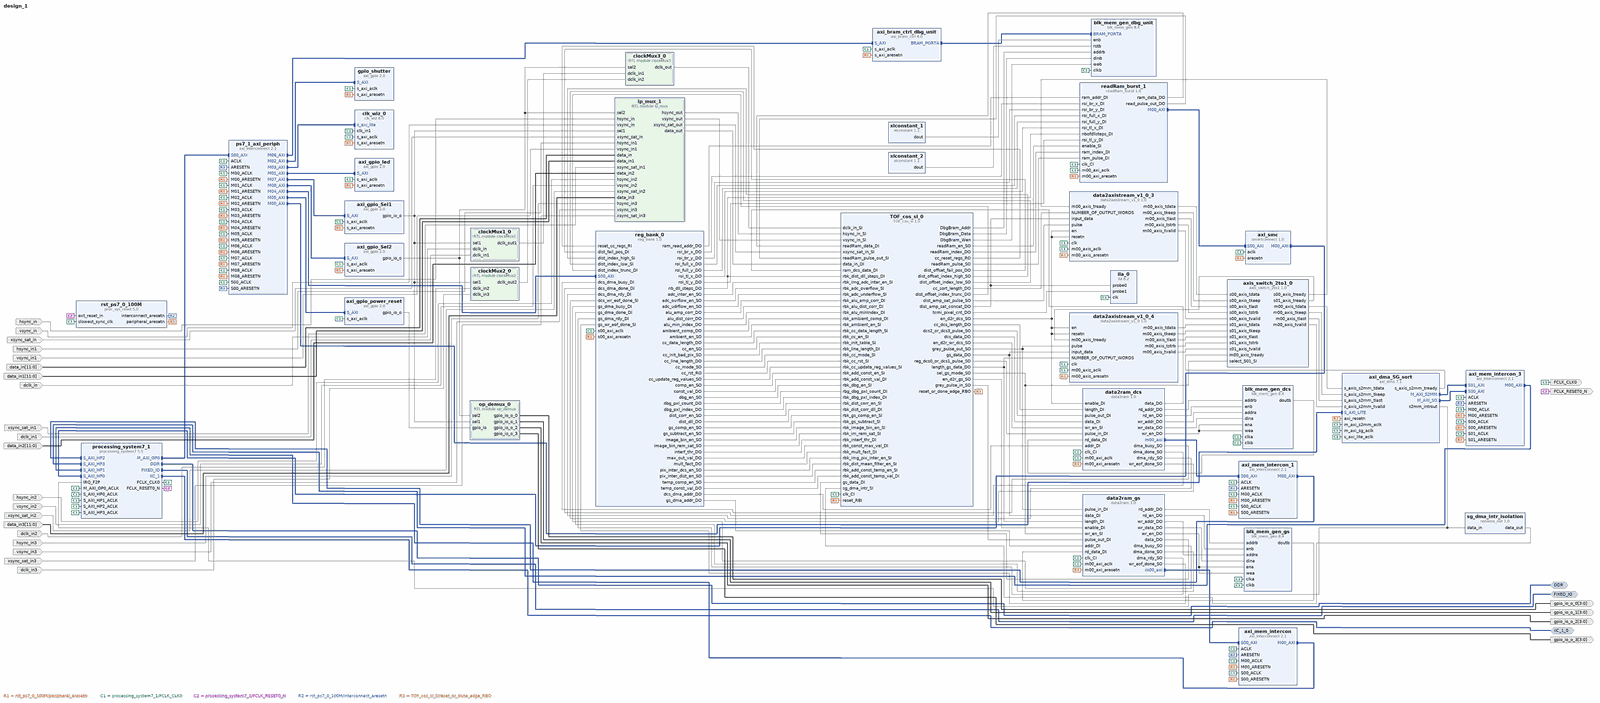
[diagram p0: block diagram of the top level, whole]
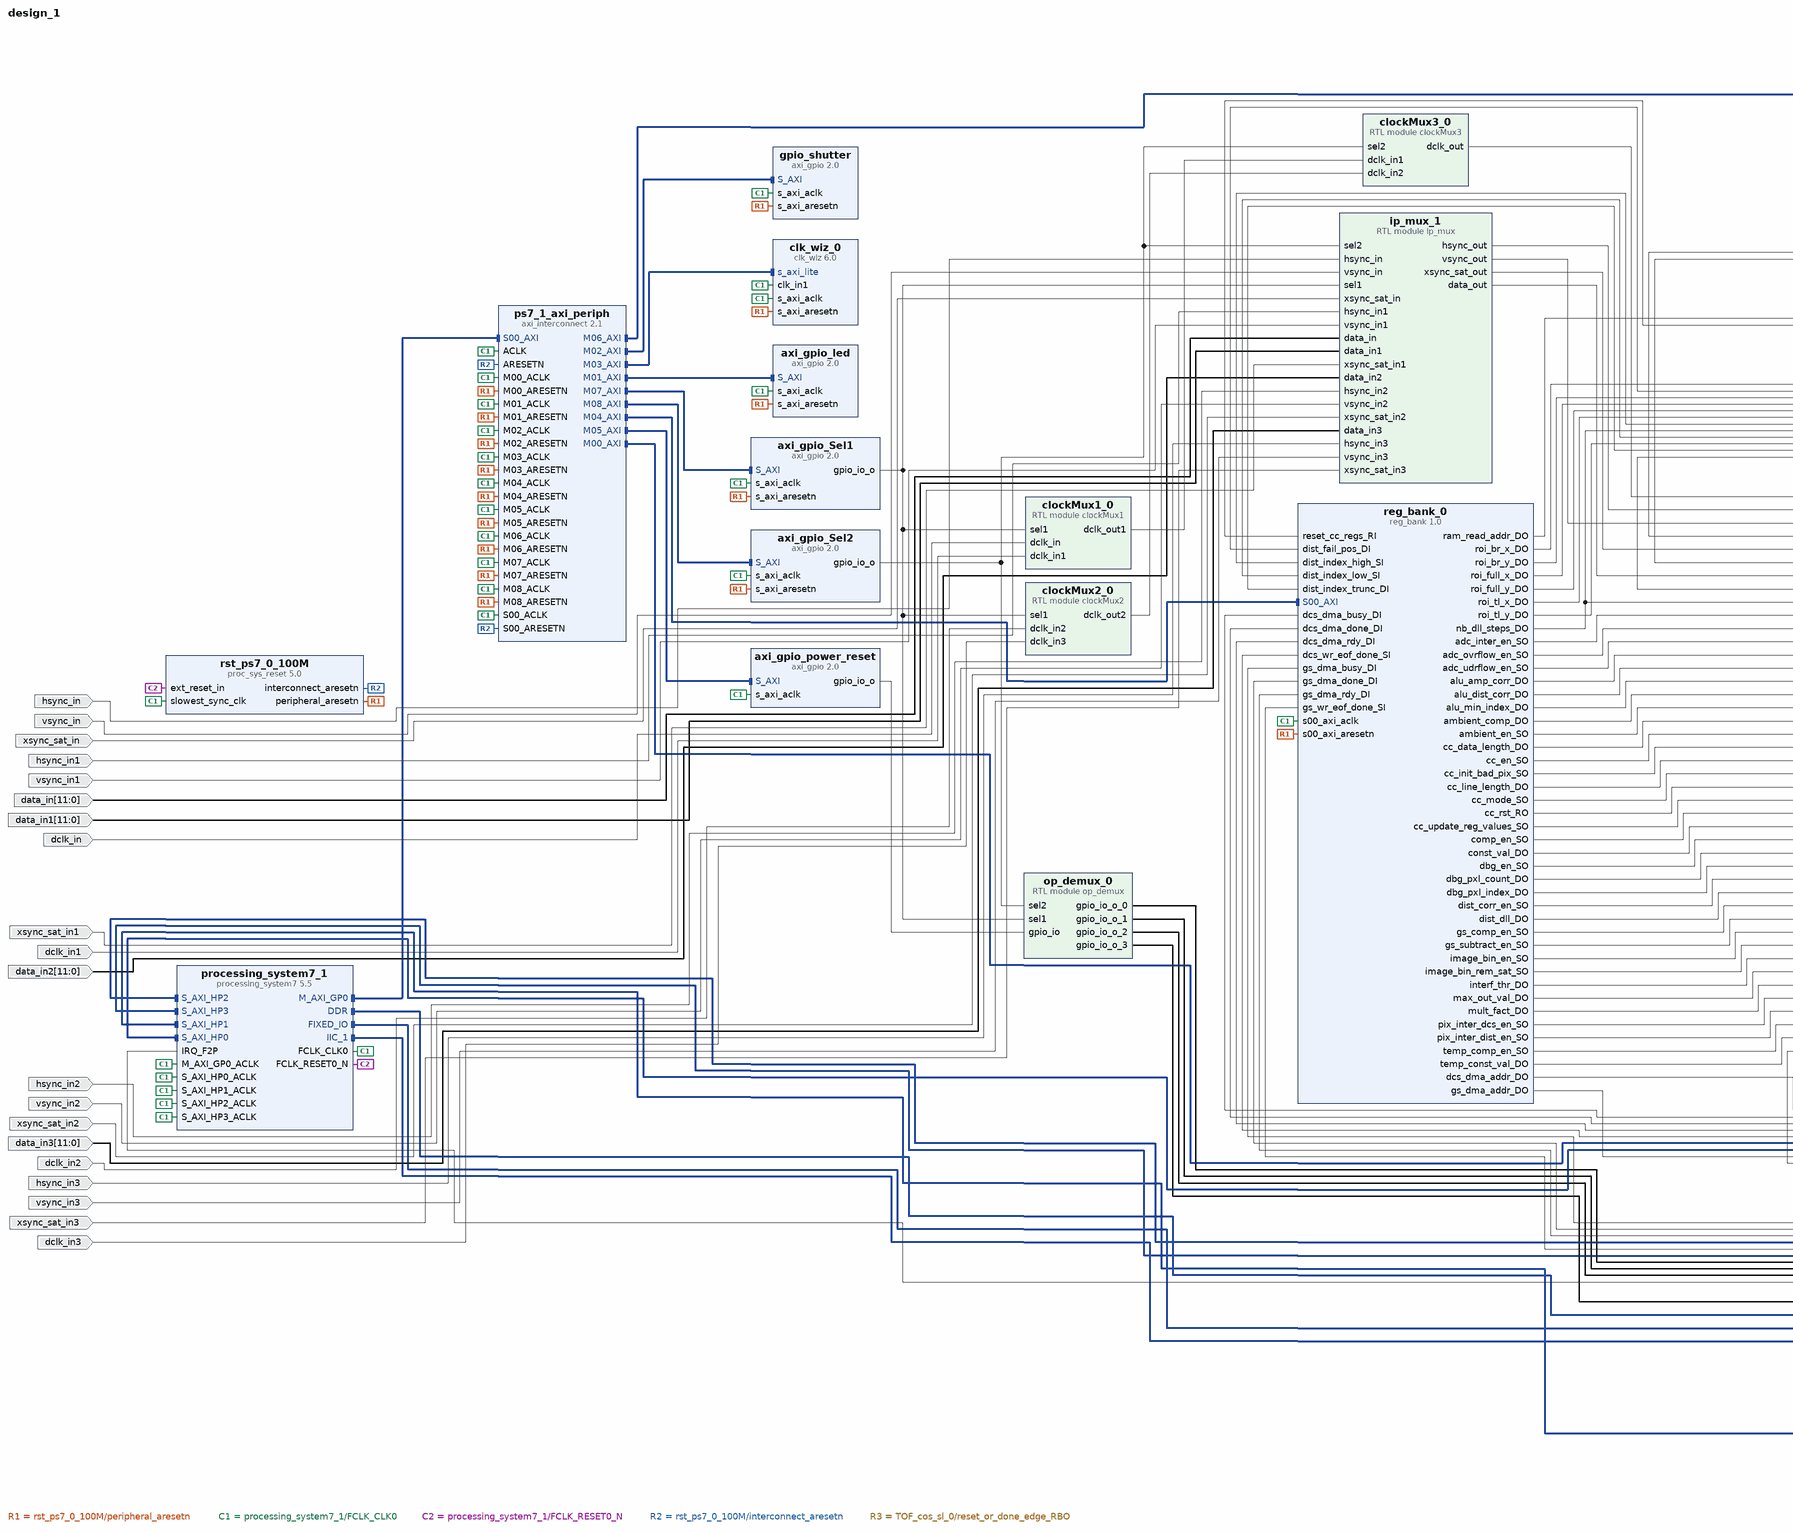
[diagram p1: block diagram of the top level, left part]
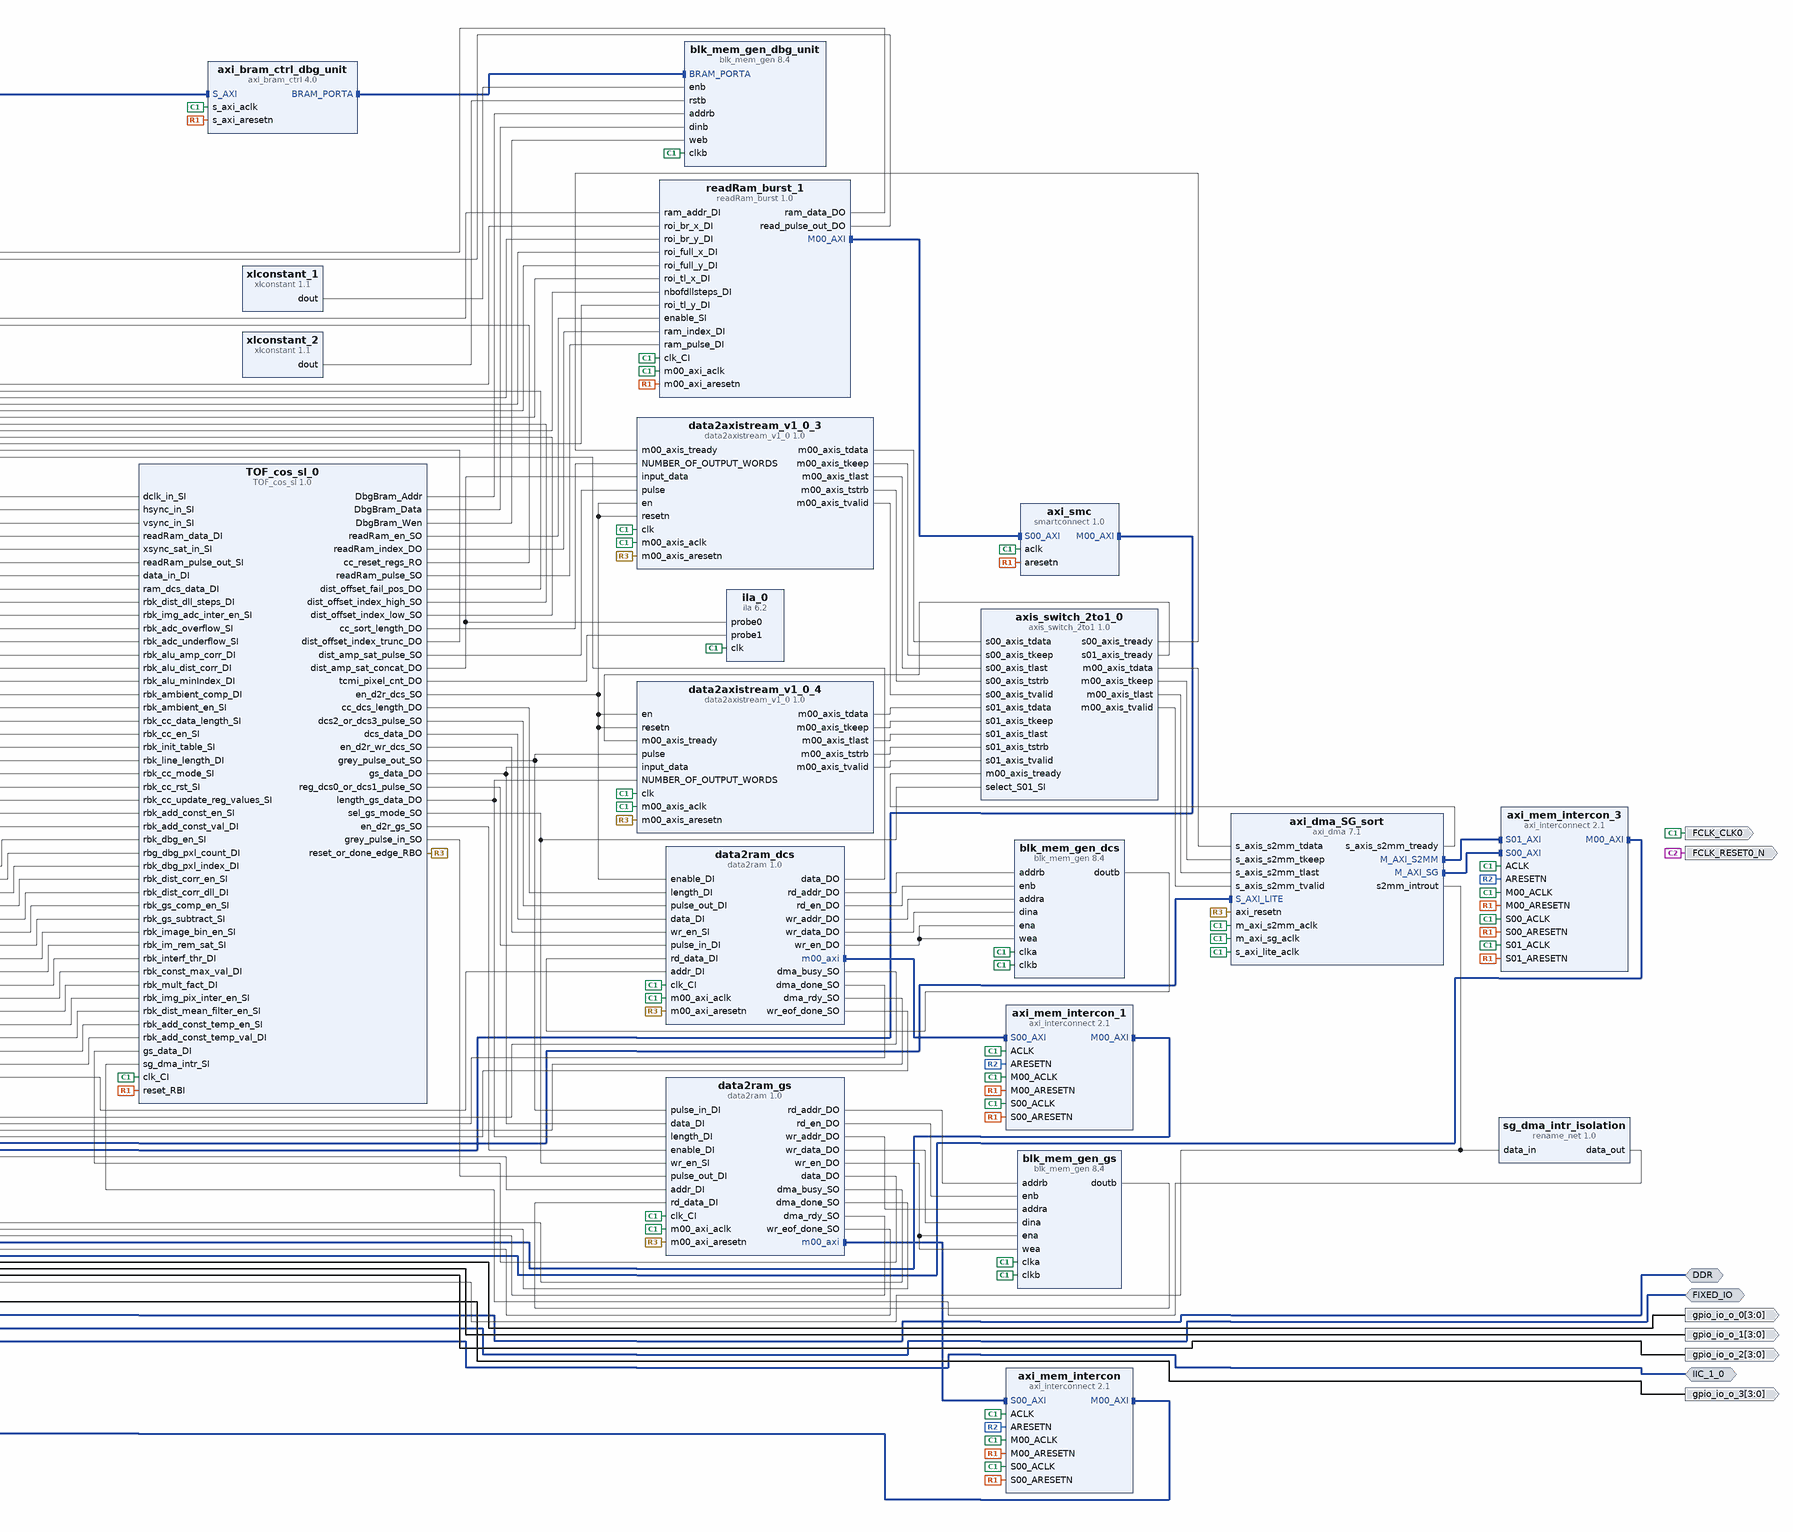
[diagram p2: block diagram of the top level, right part]
# Vivado block design design_1, xc7z020clg400-1, Vivado 2018.2.2
create_bd_design design_1

create_bd_intf_port -mode Master -vlnv xilinx.com:interface:ddrx_rtl:1.0 DDR
create_bd_intf_port -mode Master -vlnv xilinx.com:display_processing_system7:fixedio_rtl:1.0 FIXED_IO
create_bd_intf_port -mode Master -vlnv xilinx.com:interface:iic_rtl:1.0 IIC_1_0
create_bd_port -dir O FCLK_CLK0
create_bd_port -dir O FCLK_RESET0_N
create_bd_port -dir I hsync_in
create_bd_port -dir I vsync_in
create_bd_port -dir I xsync_sat_in
create_bd_port -dir I hsync_in1
create_bd_port -dir I vsync_in1
create_bd_port -dir O -from 3 -to 0 gpio_io_o_0
create_bd_port -dir O -from 3 -to 0 gpio_io_o_1
create_bd_port -dir I -from 11 -to 0 data_in
create_bd_port -dir I -from 11 -to 0 data_in1
create_bd_port -dir I xsync_sat_in1
create_bd_port -dir I dclk_in
create_bd_port -dir I dclk_in1
create_bd_port -dir I -from 11 -to 0 data_in2
create_bd_port -dir I hsync_in2
create_bd_port -dir I vsync_in2
create_bd_port -dir I xsync_sat_in2
create_bd_port -dir I -from 11 -to 0 data_in3
create_bd_port -dir I hsync_in3
create_bd_port -dir I vsync_in3
create_bd_port -dir I xsync_sat_in3
create_bd_port -dir I dclk_in2
create_bd_port -dir I dclk_in3
create_bd_port -dir O -from 3 -to 0 gpio_io_o_2
create_bd_port -dir O -from 3 -to 0 gpio_io_o_3

create_bd_cell -type ip -vlnv xilinx.com:espros:TOF_cos_sl:1.0 TOF_cos_sl_0
set_property -dict {CONFIG.ENABLE_INPUT_FIFO true} [get_bd_cells TOF_cos_sl_0]
create_bd_cell -type ip -vlnv xilinx.com:ip:axi_bram_ctrl:4.0 axi_bram_ctrl_dbg_unit
set_property -dict {CONFIG.SINGLE_PORT_BRAM 1} [get_bd_cells axi_bram_ctrl_dbg_unit]
create_bd_cell -type ip -vlnv xilinx.com:ip:axi_dma:7.1 axi_dma_SG_sort
set_property -dict [list \
  CONFIG.c_enable_multi_channel 0 \
  CONFIG.c_sg_length_width 23 \
  CONFIG.c_sg_include_stscntrl_strm 0 \
  CONFIG.c_include_mm2s 0 \
  CONFIG.c_include_s2mm_dre 0 \
  CONFIG.c_s2mm_burst_size 16 \
] [get_bd_cells axi_dma_SG_sort]
create_bd_cell -type ip -vlnv xilinx.com:ip:axi_gpio:2.0 axi_gpio_led
set_property -dict [list \
  CONFIG.C_GPIO_WIDTH 1 \
  CONFIG.C_GPIO2_WIDTH 1 \
  CONFIG.C_IS_DUAL 1 \
  CONFIG.C_ALL_INPUTS_2 0 \
  CONFIG.C_INTERRUPT_PRESENT 0 \
  CONFIG.C_ALL_OUTPUTS 1 \
  CONFIG.C_ALL_OUTPUTS_2 1 \
] [get_bd_cells axi_gpio_led]
create_bd_cell -type ip -vlnv xilinx.com:ip:axi_gpio:2.0 axi_gpio_power_reset
set_property -dict {CONFIG.C_GPIO_WIDTH 4 CONFIG.C_ALL_OUTPUTS 1} [get_bd_cells axi_gpio_power_reset]
create_bd_cell -type ip -vlnv xilinx.com:ip:axi_interconnect:2.1 axi_mem_intercon
set_property -dict {CONFIG.NUM_MI 1} [get_bd_cells axi_mem_intercon]
create_bd_cell -type ip -vlnv xilinx.com:ip:axi_interconnect:2.1 axi_mem_intercon_1
set_property -dict {CONFIG.NUM_MI 1 CONFIG.S00_HAS_DATA_FIFO 0} [get_bd_cells axi_mem_intercon_1]
create_bd_cell -type ip -vlnv xilinx.com:ip:axi_interconnect:2.1 axi_mem_intercon_3
set_property -dict {CONFIG.NUM_SI 2 CONFIG.NUM_MI 1} [get_bd_cells axi_mem_intercon_3]
create_bd_cell -type ip -vlnv xilinx.com:ip:smartconnect:1.0 axi_smc
set_property -dict {CONFIG.NUM_SI 1} [get_bd_cells axi_smc]
create_bd_cell -type ip -vlnv xilinx.com:user:axis_switch_2to1:1.0 axis_switch_2to1_0
create_bd_cell -type ip -vlnv xilinx.com:ip:blk_mem_gen:8.4 blk_mem_gen_dbg_unit
set_property -dict [list \
  CONFIG.Memory_Type True_Dual_Port_RAM \
  CONFIG.Enable_32bit_Address true \
  CONFIG.Assume_Synchronous_Clk false \
  CONFIG.Operating_Mode_A WRITE_FIRST \
  CONFIG.Enable_B Use_ENB_Pin \
  CONFIG.Register_PortA_Output_of_Memory_Primitives false \
  CONFIG.Register_PortB_Output_of_Memory_Primitives false \
  CONFIG.Use_RSTA_Pin true \
  CONFIG.Use_RSTB_Pin true \
  CONFIG.Port_B_Clock 100 \
  CONFIG.Port_B_Write_Rate 50 \
  CONFIG.Port_B_Enable_Rate 100 \
  CONFIG.use_bram_block BRAM_Controller \
  CONFIG.EN_SAFETY_CKT true \
] [get_bd_cells blk_mem_gen_dbg_unit]
create_bd_cell -type ip -vlnv xilinx.com:ip:blk_mem_gen:8.4 blk_mem_gen_dcs
set_property -dict [list \
  CONFIG.Memory_Type Simple_Dual_Port_RAM \
  CONFIG.Enable_32bit_Address false \
  CONFIG.Use_Byte_Write_Enable false \
  CONFIG.Assume_Synchronous_Clk true \
  CONFIG.Write_Width_A 16 \
  CONFIG.Write_Depth_A 2048 \
  CONFIG.Operating_Mode_A NO_CHANGE \
  CONFIG.Write_Width_B 16 \
  CONFIG.Read_Width_B 16 \
  CONFIG.Enable_B Use_ENB_Pin \
  CONFIG.Register_PortB_Output_of_Memory_Primitives true \
  CONFIG.Port_B_Clock 100 \
  CONFIG.Port_B_Enable_Rate 100 \
  CONFIG.use_bram_block Stand_Alone \
] [get_bd_cells blk_mem_gen_dcs]
create_bd_cell -type ip -vlnv xilinx.com:ip:blk_mem_gen:8.4 blk_mem_gen_gs
set_property -dict [list \
  CONFIG.Memory_Type Simple_Dual_Port_RAM \
  CONFIG.Enable_32bit_Address false \
  CONFIG.Use_Byte_Write_Enable false \
  CONFIG.Assume_Synchronous_Clk true \
  CONFIG.Write_Width_A 13 \
  CONFIG.Write_Depth_A 2048 \
  CONFIG.Operating_Mode_A NO_CHANGE \
  CONFIG.Write_Width_B 13 \
  CONFIG.Read_Width_B 13 \
  CONFIG.Enable_B Use_ENB_Pin \
  CONFIG.Register_PortB_Output_of_Memory_Primitives true \
  CONFIG.Port_B_Clock 100 \
  CONFIG.Port_B_Enable_Rate 100 \
  CONFIG.use_bram_block Stand_Alone \
] [get_bd_cells blk_mem_gen_gs]
create_bd_cell -type ip -vlnv xilinx.com:ip:clk_wiz:6.0 clk_wiz_0
set_property -dict [list \
  CONFIG.USE_FREQ_SYNTH false \
  CONFIG.USE_PHASE_ALIGNMENT false \
  CONFIG.USE_DYN_RECONFIG true \
  CONFIG.SECONDARY_SOURCE Single_ended_clock_capable_pin \
  CONFIG.CLK_OUT1_PORT epc_modclk \
  CONFIG.CLKOUT1_REQUESTED_OUT_FREQ 100.000 \
  CONFIG.CLKOUT1_DRIVES BUFG \
  CONFIG.CLKOUT2_DRIVES BUFG \
  CONFIG.CLKOUT3_DRIVES BUFG \
  CONFIG.CLKOUT4_DRIVES BUFG \
  CONFIG.CLKOUT5_DRIVES BUFG \
  CONFIG.CLKOUT6_DRIVES BUFG \
  CONFIG.CLKOUT7_DRIVES BUFG \
  CONFIG.USE_RESET true \
  CONFIG.OVERRIDE_MMCM false \
  CONFIG.MMCM_DIVCLK_DIVIDE 1 \
  CONFIG.MMCM_CLKFBOUT_MULT_F 10.000 \
  CONFIG.MMCM_CLKOUT0_DIVIDE_F 10.000 \
  CONFIG.CLKOUT1_JITTER 130.958 \
  CONFIG.CLKOUT1_PHASE_ERROR 98.575 \
] [get_bd_cells clk_wiz_0]
create_bd_cell -type ip -vlnv msc:msc:data2axistream_v1_0:1.0 data2axistream_v1_0_3
set_property -dict {CONFIG.INPUT_BUS_WIDTH 32 CONFIG.INPUT_FIFO_BITS 2} [get_bd_cells data2axistream_v1_0_3]
create_bd_cell -type ip -vlnv msc:msc:data2axistream_v1_0:1.0 data2axistream_v1_0_4
set_property -dict {CONFIG.INPUT_BUS_WIDTH 13} [get_bd_cells data2axistream_v1_0_4]
create_bd_cell -type ip -vlnv xilinx.com:user:data2ram:1.0 data2ram_dcs
set_property -dict [list \
  CONFIG.NBITS_INPUT 16 \
  CONFIG.NBITS_LENGTH 17 \
  CONFIG.NBITS_BRAM_ADDR 11 \
  CONFIG.C_M00_AXI_BURST_LEN 16 \
  CONFIG.PRELOAD_RD_PULSE true \
] [get_bd_cells data2ram_dcs]
create_bd_cell -type ip -vlnv xilinx.com:user:data2ram:1.0 data2ram_gs
set_property -dict [list \
  CONFIG.NBITS_INPUT 13 \
  CONFIG.NBITS_LENGTH 19 \
  CONFIG.NBITS_BRAM_ADDR 11 \
  CONFIG.C_M00_AXI_BURST_LEN 16 \
  CONFIG.PRELOAD_RD_PULSE true \
] [get_bd_cells data2ram_gs]
create_bd_cell -type ip -vlnv xilinx.com:ip:axi_gpio:2.0 gpio_shutter
set_property -dict [list \
  CONFIG.C_GPIO_WIDTH 1 \
  CONFIG.C_GPIO2_WIDTH 1 \
  CONFIG.C_IS_DUAL 1 \
  CONFIG.C_ALL_INPUTS_2 0 \
  CONFIG.C_ALL_OUTPUTS 1 \
  CONFIG.C_ALL_OUTPUTS_2 1 \
] [get_bd_cells gpio_shutter]
create_bd_cell -type ip -vlnv xilinx.com:ip:processing_system7:5.5 processing_system7_1
set_property -dict [list \
  CONFIG.PCW_UIPARAM_DDR_FREQ_MHZ 533.333333 \
  CONFIG.PCW_APU_PERIPHERAL_FREQMHZ 667 \
  CONFIG.PCW_SDIO_PERIPHERAL_FREQMHZ 25 \
  CONFIG.PCW_UART_PERIPHERAL_FREQMHZ 50 \
  CONFIG.PCW_I2C_PERIPHERAL_FREQMHZ 111.111115 \
  CONFIG.PCW_FPGA0_PERIPHERAL_FREQMHZ 100 \
  CONFIG.PCW_FPGA1_PERIPHERAL_FREQMHZ 20 \
  CONFIG.PCW_FPGA2_PERIPHERAL_FREQMHZ 33.333333 \
  CONFIG.PCW_USE_S_AXI_HP0 1 \
  CONFIG.PCW_USE_S_AXI_HP1 1 \
  CONFIG.PCW_USE_S_AXI_HP2 1 \
  CONFIG.PCW_USE_S_AXI_HP3 1 \
  CONFIG.PCW_USE_FABRIC_INTERRUPT 1 \
  CONFIG.PCW_GPIO_EMIO_GPIO_WIDTH 2 \
  CONFIG.PCW_IRQ_F2P_INTR 1 \
  CONFIG.PCW_GP0_EN_MODIFIABLE_TXN 0 \
  CONFIG.PCW_GP1_EN_MODIFIABLE_TXN 0 \
  CONFIG.PCW_PERIPHERAL_BOARD_PRESET part0 \
  CONFIG.PCW_PRESET_BANK1_VOLTAGE {LVCMOS 1.8V} \
  CONFIG.PCW_UIPARAM_DDR_PARTNO {MT41K256M16 RE-125} \
  CONFIG.PCW_QSPI_PERIPHERAL_ENABLE 1 \
  CONFIG.PCW_QSPI_QSPI_IO {MIO 1 .. 6} \
  CONFIG.PCW_QSPI_GRP_SINGLE_SS_ENABLE 1 \
  CONFIG.PCW_QSPI_GRP_SINGLE_SS_IO {MIO 1 .. 6} \
  CONFIG.PCW_SINGLE_QSPI_DATA_MODE x4 \
  CONFIG.PCW_QSPI_GRP_FBCLK_ENABLE 1 \
  CONFIG.PCW_QSPI_GRP_FBCLK_IO {MIO 8} \
  CONFIG.PCW_ENET0_PERIPHERAL_ENABLE 1 \
  CONFIG.PCW_ENET0_ENET0_IO {MIO 16 .. 27} \
  CONFIG.PCW_ENET0_GRP_MDIO_ENABLE 1 \
  CONFIG.PCW_ENET0_GRP_MDIO_IO {MIO 52 .. 53} \
  CONFIG.PCW_ENET_RESET_ENABLE 1 \
  CONFIG.PCW_ENET_RESET_SELECT {Share reset pin} \
  CONFIG.PCW_ENET0_RESET_ENABLE 0 \
  CONFIG.PCW_SD0_PERIPHERAL_ENABLE 1 \
  CONFIG.PCW_SD0_SD0_IO {MIO 40 .. 45} \
  CONFIG.PCW_SD0_GRP_CD_ENABLE 1 \
  CONFIG.PCW_SD0_GRP_CD_IO {MIO 46} \
  CONFIG.PCW_SD0_GRP_WP_ENABLE 1 \
  CONFIG.PCW_SD0_GRP_WP_IO {MIO 50} \
  CONFIG.PCW_UART1_PERIPHERAL_ENABLE 1 \
  CONFIG.PCW_UART1_UART1_IO {MIO 48 .. 49} \
  CONFIG.PCW_CAN0_PERIPHERAL_ENABLE 1 \
  CONFIG.PCW_CAN0_CAN0_IO {MIO 10 .. 11} \
  CONFIG.PCW_TTC0_PERIPHERAL_ENABLE 1 \
  CONFIG.PCW_TTC0_TTC0_IO EMIO \
  CONFIG.PCW_USB0_PERIPHERAL_ENABLE 1 \
  CONFIG.PCW_USB0_USB0_IO {MIO 28 .. 39} \
  CONFIG.PCW_USB_RESET_ENABLE 1 \
  CONFIG.PCW_USB_RESET_SELECT {Share reset pin} \
  CONFIG.PCW_USB0_RESET_ENABLE 1 \
  CONFIG.PCW_USB0_RESET_IO {MIO 7} \
  CONFIG.PCW_I2C0_PERIPHERAL_ENABLE 1 \
  CONFIG.PCW_I2C0_I2C0_IO {MIO 14 .. 15} \
  CONFIG.PCW_I2C0_GRP_INT_ENABLE 0 \
  CONFIG.PCW_I2C1_PERIPHERAL_ENABLE 1 \
  CONFIG.PCW_I2C1_I2C1_IO EMIO \
  CONFIG.PCW_I2C_RESET_ENABLE 0 \
  CONFIG.PCW_GPIO_PERIPHERAL_ENABLE 1 \
  CONFIG.PCW_GPIO_MIO_GPIO_ENABLE 1 \
  CONFIG.PCW_GPIO_MIO_GPIO_IO MIO \
  CONFIG.PCW_GPIO_EMIO_GPIO_ENABLE 1 \
  CONFIG.PCW_GPIO_EMIO_GPIO_IO 2 \
] [get_bd_cells processing_system7_1]
# 513 more settings of processing_system7_1 are not shown: defaults, MIO pin electricals, DDR timing, and values the tool derives
create_bd_cell -type ip -vlnv xilinx.com:ip:axi_interconnect:2.1 ps7_1_axi_periph
set_property -dict {CONFIG.NUM_MI 9 CONFIG.STRATEGY 1} [get_bd_cells ps7_1_axi_periph]
create_bd_cell -type ip -vlnv xilinx.com:user:readRam_burst:1.0 readRam_burst_1
set_property -dict {CONFIG.C_M00_AXI_ID_WIDTH 0 CONFIG.NBITS_RAM 5} [get_bd_cells readRam_burst_1]
create_bd_cell -type ip -vlnv xilinx.com:user:reg_bank:1.0 reg_bank_0
create_bd_cell -type ip -vlnv xilinx.com:ip:proc_sys_reset:5.0 rst_ps7_0_100M
create_bd_cell -type ip -vlnv msc:msc:rename_net:1.0 sg_dma_intr_isolation
set_property -dict {CONFIG.INBITS 1 CONFIG.OUTBITS 1} [get_bd_cells sg_dma_intr_isolation]
create_bd_cell -type ip -vlnv xilinx.com:ip:xlconstant:1.1 xlconstant_1
create_bd_cell -type ip -vlnv xilinx.com:ip:xlconstant:1.1 xlconstant_2
set_property -dict {CONFIG.CONST_VAL 0} [get_bd_cells xlconstant_2]
create_bd_cell -type ip -vlnv xilinx.com:ip:axi_gpio:2.0 axi_gpio_Sel1
set_property -dict {CONFIG.C_GPIO_WIDTH 1 CONFIG.C_INTERRUPT_PRESENT 0 CONFIG.C_ALL_OUTPUTS 1} [get_bd_cells axi_gpio_Sel1]
create_bd_cell -type ip -vlnv xilinx.com:ip:ila:6.2 ila_0
set_property -dict [list \
  CONFIG.C_PROBE42_WIDTH 1 \
  CONFIG.C_PROBE41_WIDTH 1 \
  CONFIG.C_PROBE39_WIDTH 1 \
  CONFIG.C_PROBE38_WIDTH 1 \
  CONFIG.C_PROBE37_WIDTH 1 \
  CONFIG.C_PROBE36_WIDTH 1 \
  CONFIG.C_PROBE35_WIDTH 1 \
  CONFIG.C_PROBE34_WIDTH 1 \
  CONFIG.C_PROBE33_WIDTH 1 \
  CONFIG.C_PROBE32_WIDTH 1 \
  CONFIG.C_PROBE31_WIDTH 1 \
  CONFIG.C_PROBE30_WIDTH 1 \
  CONFIG.C_PROBE29_WIDTH 1 \
  CONFIG.C_PROBE19_WIDTH 1 \
  CONFIG.C_PROBE18_WIDTH 1 \
  CONFIG.C_PROBE17_WIDTH 1 \
  CONFIG.C_PROBE16_WIDTH 1 \
  CONFIG.C_PROBE14_WIDTH 1 \
  CONFIG.C_PROBE13_WIDTH 1 \
  CONFIG.C_PROBE12_WIDTH 1 \
  CONFIG.C_PROBE11_WIDTH 1 \
  CONFIG.C_PROBE10_WIDTH 1 \
  CONFIG.C_PROBE9_WIDTH 1 \
  CONFIG.C_PROBE8_WIDTH 1 \
  CONFIG.C_PROBE7_WIDTH 1 \
  CONFIG.C_PROBE6_WIDTH 1 \
  CONFIG.C_PROBE5_WIDTH 1 \
  CONFIG.C_PROBE4_WIDTH 1 \
  CONFIG.C_PROBE3_WIDTH 1 \
  CONFIG.C_PROBE2_WIDTH 1 \
  CONFIG.C_PROBE1_WIDTH 17 \
  CONFIG.C_PROBE0_WIDTH 32 \
  CONFIG.C_DATA_DEPTH 32768 \
  CONFIG.C_NUM_OF_PROBES 2 \
  CONFIG.C_ENABLE_ILA_AXI_MON false \
  CONFIG.C_MONITOR_TYPE Native \
] [get_bd_cells ila_0]
create_bd_cell -type ip -vlnv xilinx.com:ip:axi_gpio:2.0 axi_gpio_Sel2
set_property -dict {CONFIG.C_GPIO_WIDTH 1 CONFIG.C_INTERRUPT_PRESENT 0 CONFIG.C_ALL_OUTPUTS 1} [get_bd_cells axi_gpio_Sel2]
create_bd_cell -type module -reference clockMux1 clockMux1_0
create_bd_cell -type module -reference clockMux2 clockMux2_0
create_bd_cell -type module -reference clockMux3 clockMux3_0
create_bd_cell -type module -reference ip_mux ip_mux_1
create_bd_cell -type module -reference op_demux op_demux_0

# ---- connections ----

connect_bd_intf_net -intf_net axi_bram_ctrl_0_BRAM_PORTA [get_bd_intf_pins axi_bram_ctrl_dbg_unit/BRAM_PORTA] [get_bd_intf_pins blk_mem_gen_dbg_unit/BRAM_PORTA]
connect_bd_intf_net [get_bd_intf_pins axi_dma_SG_sort/M_AXI_S2MM] [get_bd_intf_pins axi_mem_intercon_3/S01_AXI]
connect_bd_intf_net [get_bd_intf_pins axi_dma_SG_sort/M_AXI_SG] [get_bd_intf_pins axi_mem_intercon_3/S00_AXI]
connect_bd_intf_net [get_bd_intf_pins axi_mem_intercon_1/M00_AXI] [get_bd_intf_pins processing_system7_1/S_AXI_HP2]
connect_bd_intf_net [get_bd_intf_pins axi_mem_intercon_3/M00_AXI] [get_bd_intf_pins processing_system7_1/S_AXI_HP3]
connect_bd_intf_net [get_bd_intf_pins axi_mem_intercon/M00_AXI] [get_bd_intf_pins processing_system7_1/S_AXI_HP1]
connect_bd_intf_net [get_bd_intf_pins axi_smc/M00_AXI] [get_bd_intf_pins processing_system7_1/S_AXI_HP0]
connect_bd_intf_net [get_bd_intf_pins axi_mem_intercon_1/S00_AXI] [get_bd_intf_pins data2ram_dcs/m00_axi]
connect_bd_intf_net [get_bd_intf_pins axi_mem_intercon/S00_AXI] [get_bd_intf_pins data2ram_gs/m00_axi]
connect_bd_intf_net [get_bd_intf_pins processing_system7_1/M_AXI_GP0] [get_bd_intf_pins ps7_1_axi_periph/S00_AXI]
connect_bd_intf_net [get_bd_intf_pins axi_dma_SG_sort/S_AXI_LITE] [get_bd_intf_pins ps7_1_axi_periph/M00_AXI]
connect_bd_intf_net [get_bd_intf_pins axi_gpio_led/S_AXI] [get_bd_intf_pins ps7_1_axi_periph/M01_AXI]
connect_bd_intf_net [get_bd_intf_pins gpio_shutter/S_AXI] [get_bd_intf_pins ps7_1_axi_periph/M02_AXI]
connect_bd_intf_net [get_bd_intf_pins clk_wiz_0/s_axi_lite] [get_bd_intf_pins ps7_1_axi_periph/M03_AXI]
connect_bd_intf_net [get_bd_intf_pins ps7_1_axi_periph/M04_AXI] [get_bd_intf_pins reg_bank_0/S00_AXI]
connect_bd_intf_net [get_bd_intf_pins axi_gpio_power_reset/S_AXI] [get_bd_intf_pins ps7_1_axi_periph/M05_AXI]
connect_bd_intf_net [get_bd_intf_pins axi_bram_ctrl_dbg_unit/S_AXI] [get_bd_intf_pins ps7_1_axi_periph/M06_AXI]
connect_bd_intf_net [get_bd_intf_pins axi_smc/S00_AXI] [get_bd_intf_pins readRam_burst_1/M00_AXI]
connect_bd_intf_net [get_bd_intf_pins ps7_1_axi_periph/M07_AXI] [get_bd_intf_pins axi_gpio_Sel1/S_AXI]
connect_bd_intf_net [get_bd_intf_pins ps7_1_axi_periph/M08_AXI] [get_bd_intf_pins axi_gpio_Sel2/S_AXI]
connect_bd_intf_net [get_bd_intf_ports DDR] [get_bd_intf_pins processing_system7_1/DDR]
connect_bd_intf_net [get_bd_intf_ports FIXED_IO] [get_bd_intf_pins processing_system7_1/FIXED_IO]
connect_bd_intf_net [get_bd_intf_ports IIC_1_0] [get_bd_intf_pins processing_system7_1/IIC_1]
connect_bd_net [get_bd_pins TOF_cos_sl_0/DbgBram_Addr] [get_bd_pins blk_mem_gen_dbg_unit/addrb]
connect_bd_net [get_bd_pins TOF_cos_sl_0/DbgBram_Data] [get_bd_pins blk_mem_gen_dbg_unit/dinb]
connect_bd_net [get_bd_pins TOF_cos_sl_0/DbgBram_Wen] [get_bd_pins blk_mem_gen_dbg_unit/web]
connect_bd_net [get_bd_pins TOF_cos_sl_0/cc_dcs_length_DO] [get_bd_pins data2ram_dcs/length_DI]
connect_bd_net [get_bd_pins TOF_cos_sl_0/cc_reset_regs_RO] [get_bd_pins reg_bank_0/reset_cc_regs_RI]
connect_bd_net [get_bd_pins TOF_cos_sl_0/cc_sort_length_DO] [get_bd_pins data2axistream_v1_0_3/NUMBER_OF_OUTPUT_WORDS]
connect_bd_net [get_bd_pins TOF_cos_sl_0/dcs2_or_dcs3_pulse_SO] [get_bd_pins data2ram_dcs/pulse_out_DI]
connect_bd_net [get_bd_pins TOF_cos_sl_0/dcs_data_DO] [get_bd_pins data2ram_dcs/data_DI]
connect_bd_net [get_bd_pins TOF_cos_sl_0/dist_amp_sat_concat_DO] [get_bd_pins data2axistream_v1_0_3/input_data] [get_bd_pins ila_0/probe0]
connect_bd_net [get_bd_pins TOF_cos_sl_0/dist_amp_sat_pulse_SO] [get_bd_pins data2axistream_v1_0_3/pulse]
connect_bd_net [get_bd_pins TOF_cos_sl_0/dist_offset_fail_pos_DO] [get_bd_pins reg_bank_0/dist_fail_pos_DI]
connect_bd_net [get_bd_pins TOF_cos_sl_0/dist_offset_index_high_SO] [get_bd_pins reg_bank_0/dist_index_high_SI]
connect_bd_net [get_bd_pins TOF_cos_sl_0/dist_offset_index_low_SO] [get_bd_pins reg_bank_0/dist_index_low_SI]
connect_bd_net [get_bd_pins TOF_cos_sl_0/dist_offset_index_trunc_DO] [get_bd_pins reg_bank_0/dist_index_trunc_DI]
connect_bd_net [get_bd_pins TOF_cos_sl_0/en_d2r_gs_SO] [get_bd_pins data2ram_gs/enable_DI]
connect_bd_net [get_bd_pins TOF_cos_sl_0/en_d2r_wr_dcs_SO] [get_bd_pins data2ram_dcs/wr_en_SI]
connect_bd_net [get_bd_pins TOF_cos_sl_0/grey_pulse_in_SO] [get_bd_pins data2ram_gs/pulse_out_DI]
connect_bd_net [get_bd_pins TOF_cos_sl_0/grey_pulse_out_SO] [get_bd_pins data2axistream_v1_0_4/pulse] [get_bd_pins data2ram_gs/pulse_in_DI]
connect_bd_net [get_bd_pins TOF_cos_sl_0/readRam_en_SO] [get_bd_pins readRam_burst_1/enable_SI]
connect_bd_net [get_bd_pins TOF_cos_sl_0/readRam_index_DO] [get_bd_pins readRam_burst_1/ram_index_DI]
connect_bd_net [get_bd_pins TOF_cos_sl_0/readRam_pulse_SO] [get_bd_pins readRam_burst_1/ram_pulse_DI]
connect_bd_net [get_bd_pins TOF_cos_sl_0/reg_dcs0_or_dcs1_pulse_SO] [get_bd_pins data2ram_dcs/pulse_in_DI]
connect_bd_net [get_bd_pins axi_dma_SG_sort/s2mm_introut] [get_bd_pins processing_system7_1/IRQ_F2P] [get_bd_pins sg_dma_intr_isolation/data_in]
connect_bd_net [get_bd_pins axi_dma_SG_sort/s_axis_s2mm_tready] [get_bd_pins axis_switch_2to1_0/m00_axis_tready]
connect_bd_net -net axi_peri_resetn [get_bd_pins rst_ps7_0_100M/peripheral_aresetn] \
  [get_bd_pins TOF_cos_sl_0/reset_RBI] [get_bd_pins axi_bram_ctrl_dbg_unit/s_axi_aresetn] \
  [get_bd_pins axi_gpio_led/s_axi_aresetn] [get_bd_pins axi_smc/aresetn] [get_bd_pins clk_wiz_0/s_axi_aresetn] \
  [get_bd_pins gpio_shutter/s_axi_aresetn] [get_bd_pins readRam_burst_1/m00_axi_aresetn] \
  [get_bd_pins reg_bank_0/s00_axi_aresetn] [get_bd_pins axi_gpio_Sel1/s_axi_aresetn] \
  [get_bd_pins axi_gpio_Sel2/s_axi_aresetn] [get_bd_pins axi_mem_intercon/M00_ARESETN] \
  [get_bd_pins axi_mem_intercon/S00_ARESETN] [get_bd_pins axi_mem_intercon_1/M00_ARESETN] \
  [get_bd_pins axi_mem_intercon_1/S00_ARESETN] [get_bd_pins axi_mem_intercon_3/M00_ARESETN] \
  [get_bd_pins axi_mem_intercon_3/S00_ARESETN] [get_bd_pins axi_mem_intercon_3/S01_ARESETN] \
  [get_bd_pins ps7_1_axi_periph/M00_ARESETN] [get_bd_pins ps7_1_axi_periph/M01_ARESETN] \
  [get_bd_pins ps7_1_axi_periph/M02_ARESETN] [get_bd_pins ps7_1_axi_periph/M03_ARESETN] \
  [get_bd_pins ps7_1_axi_periph/M04_ARESETN] [get_bd_pins ps7_1_axi_periph/M05_ARESETN] \
  [get_bd_pins ps7_1_axi_periph/M06_ARESETN] [get_bd_pins ps7_1_axi_periph/M07_ARESETN] \
  [get_bd_pins ps7_1_axi_periph/M08_ARESETN]
connect_bd_net [get_bd_pins axis_switch_2to1_0/m00_axis_tdata] [get_bd_pins axi_dma_SG_sort/s_axis_s2mm_tdata]
connect_bd_net [get_bd_pins axis_switch_2to1_0/m00_axis_tkeep] [get_bd_pins axi_dma_SG_sort/s_axis_s2mm_tkeep]
connect_bd_net [get_bd_pins axis_switch_2to1_0/m00_axis_tlast] [get_bd_pins axi_dma_SG_sort/s_axis_s2mm_tlast]
connect_bd_net [get_bd_pins axis_switch_2to1_0/m00_axis_tvalid] [get_bd_pins axi_dma_SG_sort/s_axis_s2mm_tvalid]
connect_bd_net [get_bd_pins axis_switch_2to1_0/s00_axis_tready] [get_bd_pins data2axistream_v1_0_3/m00_axis_tready]
connect_bd_net [get_bd_pins axis_switch_2to1_0/s01_axis_tready] [get_bd_pins data2axistream_v1_0_4/m00_axis_tready]
connect_bd_net [get_bd_pins blk_mem_gen_dcs/doutb] [get_bd_pins data2ram_dcs/rd_data_DI]
connect_bd_net [get_bd_pins blk_mem_gen_gs/doutb] [get_bd_pins data2ram_gs/rd_data_DI]
connect_bd_net -net camera_ctrl_v1_0_0_tcmi_en [get_bd_pins TOF_cos_sl_0/en_d2r_dcs_SO] \
  [get_bd_pins data2axistream_v1_0_3/en] [get_bd_pins data2axistream_v1_0_3/resetn] [get_bd_pins data2axistream_v1_0_4/en] \
  [get_bd_pins data2axistream_v1_0_4/resetn] [get_bd_pins data2ram_dcs/enable_DI]
connect_bd_net [get_bd_pins data2axistream_v1_0_3/m00_axis_tdata] [get_bd_pins axis_switch_2to1_0/s00_axis_tdata]
connect_bd_net [get_bd_pins data2axistream_v1_0_3/m00_axis_tkeep] [get_bd_pins axis_switch_2to1_0/s00_axis_tkeep]
connect_bd_net [get_bd_pins data2axistream_v1_0_3/m00_axis_tlast] [get_bd_pins axis_switch_2to1_0/s00_axis_tlast]
connect_bd_net [get_bd_pins data2axistream_v1_0_3/m00_axis_tstrb] [get_bd_pins axis_switch_2to1_0/s00_axis_tstrb]
connect_bd_net [get_bd_pins data2axistream_v1_0_3/m00_axis_tvalid] [get_bd_pins axis_switch_2to1_0/s00_axis_tvalid]
connect_bd_net [get_bd_pins data2axistream_v1_0_4/m00_axis_tdata] [get_bd_pins axis_switch_2to1_0/s01_axis_tdata]
connect_bd_net [get_bd_pins data2axistream_v1_0_4/m00_axis_tkeep] [get_bd_pins axis_switch_2to1_0/s01_axis_tkeep]
connect_bd_net [get_bd_pins data2axistream_v1_0_4/m00_axis_tlast] [get_bd_pins axis_switch_2to1_0/s01_axis_tlast]
connect_bd_net [get_bd_pins data2axistream_v1_0_4/m00_axis_tstrb] [get_bd_pins axis_switch_2to1_0/s01_axis_tstrb]
connect_bd_net [get_bd_pins data2axistream_v1_0_4/m00_axis_tvalid] [get_bd_pins axis_switch_2to1_0/s01_axis_tvalid]
connect_bd_net [get_bd_pins data2ram_dcs/data_DO] [get_bd_pins TOF_cos_sl_0/ram_dcs_data_DI]
connect_bd_net [get_bd_pins data2ram_dcs/dma_busy_SO] [get_bd_pins reg_bank_0/dcs_dma_busy_DI]
connect_bd_net [get_bd_pins data2ram_dcs/dma_done_SO] [get_bd_pins reg_bank_0/dcs_dma_done_DI]
connect_bd_net [get_bd_pins data2ram_dcs/dma_rdy_SO] [get_bd_pins reg_bank_0/dcs_dma_rdy_DI]
connect_bd_net [get_bd_pins data2ram_dcs/rd_addr_DO] [get_bd_pins blk_mem_gen_dcs/addrb]
connect_bd_net [get_bd_pins data2ram_dcs/rd_en_DO] [get_bd_pins blk_mem_gen_dcs/enb]
connect_bd_net [get_bd_pins data2ram_dcs/wr_addr_DO] [get_bd_pins blk_mem_gen_dcs/addra]
connect_bd_net [get_bd_pins data2ram_dcs/wr_data_DO] [get_bd_pins blk_mem_gen_dcs/dina]
connect_bd_net [get_bd_pins data2ram_dcs/wr_en_DO] [get_bd_pins blk_mem_gen_dcs/ena] [get_bd_pins blk_mem_gen_dcs/wea]
connect_bd_net [get_bd_pins data2ram_dcs/wr_eof_done_SO] [get_bd_pins reg_bank_0/dcs_wr_eof_done_SI]
connect_bd_net [get_bd_pins data2ram_gs/data_DO] [get_bd_pins TOF_cos_sl_0/gs_data_DI]
connect_bd_net [get_bd_pins data2ram_gs/dma_busy_SO] [get_bd_pins reg_bank_0/gs_dma_busy_DI]
connect_bd_net [get_bd_pins data2ram_gs/dma_done_SO] [get_bd_pins reg_bank_0/gs_dma_done_DI]
connect_bd_net [get_bd_pins data2ram_gs/dma_rdy_SO] [get_bd_pins reg_bank_0/gs_dma_rdy_DI]
connect_bd_net [get_bd_pins data2ram_gs/rd_addr_DO] [get_bd_pins blk_mem_gen_gs/addrb]
connect_bd_net [get_bd_pins data2ram_gs/rd_en_DO] [get_bd_pins blk_mem_gen_gs/enb]
connect_bd_net [get_bd_pins data2ram_gs/wr_addr_DO] [get_bd_pins blk_mem_gen_gs/addra]
connect_bd_net [get_bd_pins data2ram_gs/wr_data_DO] [get_bd_pins blk_mem_gen_gs/dina]
connect_bd_net [get_bd_pins data2ram_gs/wr_en_DO] [get_bd_pins blk_mem_gen_gs/ena] [get_bd_pins blk_mem_gen_gs/wea]
connect_bd_net [get_bd_pins data2ram_gs/wr_eof_done_SO] [get_bd_pins reg_bank_0/gs_wr_eof_done_SI]
connect_bd_net -net gs_subtract_0_gs_DO [get_bd_pins TOF_cos_sl_0/gs_data_DO] \
  [get_bd_pins data2axistream_v1_0_4/input_data] [get_bd_pins data2ram_gs/data_DI]
connect_bd_net -net processing_system7_0_FCLK_CLK0 [get_bd_pins processing_system7_1/FCLK_CLK0] \
  [get_bd_ports FCLK_CLK0] [get_bd_pins TOF_cos_sl_0/clk_CI] [get_bd_pins axi_bram_ctrl_dbg_unit/s_axi_aclk] \
  [get_bd_pins axi_dma_SG_sort/m_axi_s2mm_aclk] [get_bd_pins axi_dma_SG_sort/m_axi_sg_aclk] \
  [get_bd_pins axi_dma_SG_sort/s_axi_lite_aclk] [get_bd_pins axi_gpio_led/s_axi_aclk] \
  [get_bd_pins axi_gpio_power_reset/s_axi_aclk] [get_bd_pins axi_smc/aclk] [get_bd_pins blk_mem_gen_dbg_unit/clkb] \
  [get_bd_pins blk_mem_gen_dcs/clka] [get_bd_pins blk_mem_gen_dcs/clkb] [get_bd_pins blk_mem_gen_gs/clka] \
  [get_bd_pins blk_mem_gen_gs/clkb] [get_bd_pins clk_wiz_0/clk_in1] [get_bd_pins clk_wiz_0/s_axi_aclk] \
  [get_bd_pins data2axistream_v1_0_3/clk] [get_bd_pins data2axistream_v1_0_3/m00_axis_aclk] \
  [get_bd_pins data2axistream_v1_0_4/clk] [get_bd_pins data2axistream_v1_0_4/m00_axis_aclk] [get_bd_pins data2ram_dcs/clk_CI] \
  [get_bd_pins data2ram_dcs/m00_axi_aclk] [get_bd_pins data2ram_gs/clk_CI] [get_bd_pins data2ram_gs/m00_axi_aclk] \
  [get_bd_pins gpio_shutter/s_axi_aclk] [get_bd_pins processing_system7_1/M_AXI_GP0_ACLK] \
  [get_bd_pins processing_system7_1/S_AXI_HP0_ACLK] [get_bd_pins processing_system7_1/S_AXI_HP1_ACLK] \
  [get_bd_pins processing_system7_1/S_AXI_HP2_ACLK] [get_bd_pins processing_system7_1/S_AXI_HP3_ACLK] \
  [get_bd_pins readRam_burst_1/clk_CI] [get_bd_pins readRam_burst_1/m00_axi_aclk] [get_bd_pins reg_bank_0/s00_axi_aclk] \
  [get_bd_pins rst_ps7_0_100M/slowest_sync_clk] [get_bd_pins axi_gpio_Sel1/s_axi_aclk] [get_bd_pins ila_0/clk] \
  [get_bd_pins axi_gpio_Sel2/s_axi_aclk] [get_bd_pins axi_mem_intercon/ACLK] [get_bd_pins axi_mem_intercon/M00_ACLK] \
  [get_bd_pins axi_mem_intercon/S00_ACLK] [get_bd_pins axi_mem_intercon_1/ACLK] [get_bd_pins axi_mem_intercon_1/M00_ACLK] \
  [get_bd_pins axi_mem_intercon_1/S00_ACLK] [get_bd_pins axi_mem_intercon_3/ACLK] [get_bd_pins axi_mem_intercon_3/M00_ACLK] \
  [get_bd_pins axi_mem_intercon_3/S00_ACLK] [get_bd_pins axi_mem_intercon_3/S01_ACLK] [get_bd_pins ps7_1_axi_periph/ACLK] \
  [get_bd_pins ps7_1_axi_periph/M00_ACLK] [get_bd_pins ps7_1_axi_periph/M01_ACLK] [get_bd_pins ps7_1_axi_periph/M02_ACLK] \
  [get_bd_pins ps7_1_axi_periph/M03_ACLK] [get_bd_pins ps7_1_axi_periph/M04_ACLK] [get_bd_pins ps7_1_axi_periph/M05_ACLK] \
  [get_bd_pins ps7_1_axi_periph/M06_ACLK] [get_bd_pins ps7_1_axi_periph/S00_ACLK] [get_bd_pins ps7_1_axi_periph/M07_ACLK] \
  [get_bd_pins ps7_1_axi_periph/M08_ACLK]
connect_bd_net [get_bd_pins processing_system7_1/FCLK_RESET0_N] [get_bd_ports FCLK_RESET0_N] [get_bd_pins rst_ps7_0_100M/ext_reset_in]
connect_bd_net [get_bd_pins readRam_burst_1/ram_data_DO] [get_bd_pins TOF_cos_sl_0/readRam_data_DI]
connect_bd_net [get_bd_pins readRam_burst_1/read_pulse_out_DO] [get_bd_pins TOF_cos_sl_0/readRam_pulse_out_SI]
connect_bd_net [get_bd_pins reg_bank_0/adc_inter_en_SO] [get_bd_pins TOF_cos_sl_0/rbk_img_adc_inter_en_SI]
connect_bd_net [get_bd_pins reg_bank_0/adc_ovrflow_en_SO] [get_bd_pins TOF_cos_sl_0/rbk_adc_overflow_SI]
connect_bd_net [get_bd_pins reg_bank_0/adc_udrflow_en_SO] [get_bd_pins TOF_cos_sl_0/rbk_adc_underflow_SI]
connect_bd_net [get_bd_pins reg_bank_0/alu_amp_corr_DO] [get_bd_pins TOF_cos_sl_0/rbk_alu_amp_corr_DI]
connect_bd_net [get_bd_pins reg_bank_0/alu_dist_corr_DO] [get_bd_pins TOF_cos_sl_0/rbk_alu_dist_corr_DI]
connect_bd_net [get_bd_pins reg_bank_0/alu_min_index_DO] [get_bd_pins TOF_cos_sl_0/rbk_alu_minIndex_DI]
connect_bd_net [get_bd_pins reg_bank_0/ambient_comp_DO] [get_bd_pins TOF_cos_sl_0/rbk_ambient_comp_DI]
connect_bd_net [get_bd_pins reg_bank_0/ambient_en_SO] [get_bd_pins TOF_cos_sl_0/rbk_ambient_en_SI]
connect_bd_net [get_bd_pins reg_bank_0/cc_data_length_DO] [get_bd_pins TOF_cos_sl_0/rbk_cc_data_length_SI]
connect_bd_net [get_bd_pins reg_bank_0/cc_en_SO] [get_bd_pins TOF_cos_sl_0/rbk_cc_en_SI]
connect_bd_net [get_bd_pins reg_bank_0/cc_init_bad_pix_SO] [get_bd_pins TOF_cos_sl_0/rbk_init_table_SI]
connect_bd_net [get_bd_pins reg_bank_0/cc_line_length_DO] [get_bd_pins TOF_cos_sl_0/rbk_line_length_DI]
connect_bd_net [get_bd_pins reg_bank_0/cc_mode_SO] [get_bd_pins TOF_cos_sl_0/rbk_cc_mode_SI]
connect_bd_net [get_bd_pins reg_bank_0/cc_rst_RO] [get_bd_pins TOF_cos_sl_0/rbk_cc_rst_SI]
connect_bd_net [get_bd_pins reg_bank_0/cc_update_reg_values_SO] [get_bd_pins TOF_cos_sl_0/rbk_cc_update_reg_values_SI]
connect_bd_net [get_bd_pins reg_bank_0/comp_en_SO] [get_bd_pins TOF_cos_sl_0/rbk_add_const_en_SI]
connect_bd_net [get_bd_pins reg_bank_0/const_val_DO] [get_bd_pins TOF_cos_sl_0/rbk_add_const_val_DI]
connect_bd_net -net reg_bank_0_dbg_en_SI [get_bd_pins reg_bank_0/dbg_en_SO] [get_bd_pins TOF_cos_sl_0/rbk_dbg_en_SI]
connect_bd_net -net reg_bank_0_dbg_pxl_count_DI [get_bd_pins reg_bank_0/dbg_pxl_count_DO] [get_bd_pins TOF_cos_sl_0/rbg_dbg_pxl_count_DI]
connect_bd_net -net reg_bank_0_dbg_pxl_index_DI [get_bd_pins reg_bank_0/dbg_pxl_index_DO] [get_bd_pins TOF_cos_sl_0/rbk_dbg_pxl_index_DI]
connect_bd_net [get_bd_pins reg_bank_0/dcs_dma_addr_DO] [get_bd_pins data2ram_dcs/addr_DI]
connect_bd_net [get_bd_pins reg_bank_0/dist_corr_en_SO] [get_bd_pins TOF_cos_sl_0/rbk_dist_corr_en_SI]
connect_bd_net [get_bd_pins reg_bank_0/dist_dll_DO] [get_bd_pins TOF_cos_sl_0/rbk_dist_corr_dll_DI]
connect_bd_net [get_bd_pins reg_bank_0/gs_comp_en_SO] [get_bd_pins TOF_cos_sl_0/rbk_gs_comp_en_SI]
connect_bd_net [get_bd_pins reg_bank_0/gs_dma_addr_DO] [get_bd_pins data2ram_gs/addr_DI]
connect_bd_net [get_bd_pins reg_bank_0/gs_subtract_en_SO] [get_bd_pins TOF_cos_sl_0/rbk_gs_subtract_SI]
connect_bd_net [get_bd_pins reg_bank_0/image_bin_en_SO] [get_bd_pins TOF_cos_sl_0/rbk_image_bin_en_SI]
connect_bd_net [get_bd_pins reg_bank_0/image_bin_rem_sat_SO] [get_bd_pins TOF_cos_sl_0/rbk_im_rem_sat_SI]
connect_bd_net [get_bd_pins reg_bank_0/interf_thr_DO] [get_bd_pins TOF_cos_sl_0/rbk_interf_thr_DI]
connect_bd_net [get_bd_pins reg_bank_0/max_out_val_DO] [get_bd_pins TOF_cos_sl_0/rbk_const_max_val_DI]
connect_bd_net [get_bd_pins reg_bank_0/mult_fact_DO] [get_bd_pins TOF_cos_sl_0/rbk_mult_fact_DI]
connect_bd_net [get_bd_pins reg_bank_0/nb_dll_steps_DO] [get_bd_pins TOF_cos_sl_0/rbk_dist_dll_steps_DI] [get_bd_pins readRam_burst_1/nbofdllsteps_DI]
connect_bd_net [get_bd_pins reg_bank_0/pix_inter_dcs_en_SO] [get_bd_pins TOF_cos_sl_0/rbk_img_pix_inter_en_SI]
connect_bd_net [get_bd_pins reg_bank_0/pix_inter_dist_en_SO] [get_bd_pins TOF_cos_sl_0/rbk_dist_mean_filter_en_SI]
connect_bd_net [get_bd_pins reg_bank_0/ram_read_addr_DO] [get_bd_pins readRam_burst_1/ram_addr_DI]
connect_bd_net [get_bd_pins reg_bank_0/roi_br_x_DO] [get_bd_pins readRam_burst_1/roi_br_x_DI]
connect_bd_net [get_bd_pins reg_bank_0/roi_br_y_DO] [get_bd_pins readRam_burst_1/roi_br_y_DI]
connect_bd_net [get_bd_pins reg_bank_0/roi_full_x_DO] [get_bd_pins readRam_burst_1/roi_full_x_DI]
connect_bd_net [get_bd_pins reg_bank_0/roi_full_y_DO] [get_bd_pins readRam_burst_1/roi_full_y_DI]
connect_bd_net [get_bd_pins reg_bank_0/roi_tl_x_DO] [get_bd_pins readRam_burst_1/roi_tl_x_DI]
connect_bd_net [get_bd_pins reg_bank_0/roi_tl_y_DO] [get_bd_pins readRam_burst_1/roi_tl_y_DI]
connect_bd_net [get_bd_pins reg_bank_0/temp_comp_en_SO] [get_bd_pins TOF_cos_sl_0/rbk_add_const_temp_en_SI]
connect_bd_net [get_bd_pins reg_bank_0/temp_const_val_DO] [get_bd_pins TOF_cos_sl_0/rbk_add_const_temp_val_DI]
connect_bd_net [get_bd_pins rst_ps7_0_100M/interconnect_aresetn] \
  [get_bd_pins axi_mem_intercon/ARESETN] [get_bd_pins axi_mem_intercon_1/ARESETN] [get_bd_pins axi_mem_intercon_3/ARESETN] \
  [get_bd_pins ps7_1_axi_periph/ARESETN] [get_bd_pins ps7_1_axi_periph/S00_ARESETN]
connect_bd_net [get_bd_pins sg_dma_intr_isolation/data_out] [get_bd_pins TOF_cos_sl_0/sg_dma_intr_SI]
connect_bd_net -net util_vector_logic_5_Res [get_bd_pins TOF_cos_sl_0/reset_or_done_edge_RBO] \
  [get_bd_pins axi_dma_SG_sort/axi_resetn] [get_bd_pins data2axistream_v1_0_3/m00_axis_aresetn] \
  [get_bd_pins data2axistream_v1_0_4/m00_axis_aresetn] [get_bd_pins data2ram_dcs/m00_axi_aresetn] \
  [get_bd_pins data2ram_gs/m00_axi_aresetn]
connect_bd_net -net xlconcat_0_dout [get_bd_pins TOF_cos_sl_0/length_gs_data_DO] \
  [get_bd_pins data2axistream_v1_0_4/NUMBER_OF_OUTPUT_WORDS] [get_bd_pins data2ram_gs/length_DI]
connect_bd_net [get_bd_pins xlconstant_1/dout] [get_bd_pins blk_mem_gen_dbg_unit/enb]
connect_bd_net [get_bd_pins xlconstant_2/dout] [get_bd_pins blk_mem_gen_dbg_unit/rstb]
connect_bd_net -net xlslice_2_Dout [get_bd_pins TOF_cos_sl_0/sel_gs_mode_SO] \
  [get_bd_pins axis_switch_2to1_0/select_S01_SI] [get_bd_pins data2ram_gs/wr_en_SI]
connect_bd_net [get_bd_ports hsync_in] [get_bd_pins ip_mux_1/hsync_in]
connect_bd_net [get_bd_ports vsync_in] [get_bd_pins ip_mux_1/vsync_in]
connect_bd_net [get_bd_ports xsync_sat_in] [get_bd_pins ip_mux_1/xsync_sat_in]
connect_bd_net -net hsync_in1_1 [get_bd_ports hsync_in1] [get_bd_pins ip_mux_1/hsync_in1]
connect_bd_net -net vsync_in1_1 [get_bd_ports vsync_in1] [get_bd_pins ip_mux_1/vsync_in1]
connect_bd_net [get_bd_pins ip_mux_1/hsync_out] [get_bd_pins TOF_cos_sl_0/hsync_in_SI]
connect_bd_net [get_bd_pins ip_mux_1/vsync_out] [get_bd_pins TOF_cos_sl_0/vsync_in_SI]
connect_bd_net [get_bd_pins ip_mux_1/xsync_sat_out] [get_bd_pins TOF_cos_sl_0/xsync_sat_in_SI]
connect_bd_net [get_bd_pins op_demux_0/gpio_io_o_0] [get_bd_ports gpio_io_o_0]
connect_bd_net [get_bd_pins op_demux_0/gpio_io_o_1] [get_bd_ports gpio_io_o_1]
connect_bd_net [get_bd_pins axi_gpio_power_reset/gpio_io_o] [get_bd_pins op_demux_0/gpio_io]
connect_bd_net [get_bd_ports data_in] [get_bd_pins ip_mux_1/data_in]
connect_bd_net -net data_in1_1 [get_bd_ports data_in1] [get_bd_pins ip_mux_1/data_in1]
connect_bd_net [get_bd_pins ip_mux_1/data_out] [get_bd_pins TOF_cos_sl_0/data_in_DI]
connect_bd_net -net axi_gpio_Sel_gpio_io_o [get_bd_pins axi_gpio_Sel1/gpio_io_o] \
  [get_bd_pins clockMux1_0/sel1] [get_bd_pins clockMux2_0/sel1] [get_bd_pins ip_mux_1/sel1] [get_bd_pins op_demux_0/sel1]
connect_bd_net -net xsync_sat_in1_1 [get_bd_ports xsync_sat_in1] [get_bd_pins ip_mux_1/xsync_sat_in1]
connect_bd_net [get_bd_ports dclk_in] [get_bd_pins clockMux1_0/dclk_in]
connect_bd_net -net dclk_in1_1 [get_bd_ports dclk_in1] [get_bd_pins clockMux1_0/dclk_in1]
connect_bd_net -net data_in2_1 [get_bd_ports data_in2] [get_bd_pins ip_mux_1/data_in2]
connect_bd_net -net hsync_in2_1 [get_bd_ports hsync_in2] [get_bd_pins ip_mux_1/hsync_in2]
connect_bd_net -net vsync_in2_1 [get_bd_ports vsync_in2] [get_bd_pins ip_mux_1/vsync_in2]
connect_bd_net -net xsync_sat_in2_1 [get_bd_ports xsync_sat_in2] [get_bd_pins ip_mux_1/xsync_sat_in2]
connect_bd_net -net data_in3_1 [get_bd_ports data_in3] [get_bd_pins ip_mux_1/data_in3]
connect_bd_net -net hsync_in3_1 [get_bd_ports hsync_in3] [get_bd_pins ip_mux_1/hsync_in3]
connect_bd_net -net vsync_in3_1 [get_bd_ports vsync_in3] [get_bd_pins ip_mux_1/vsync_in3]
connect_bd_net -net xsync_sat_in3_1 [get_bd_ports xsync_sat_in3] [get_bd_pins ip_mux_1/xsync_sat_in3]
connect_bd_net -net dclk_in2_1 [get_bd_ports dclk_in2] [get_bd_pins clockMux2_0/dclk_in2]
connect_bd_net -net dclk_in3_1 [get_bd_ports dclk_in3] [get_bd_pins clockMux2_0/dclk_in3]
connect_bd_net [get_bd_pins axi_gpio_Sel2/gpio_io_o] [get_bd_pins clockMux3_0/sel2] [get_bd_pins ip_mux_1/sel2] [get_bd_pins op_demux_0/sel2]
connect_bd_net [get_bd_pins clockMux1_0/dclk_out1] [get_bd_pins clockMux3_0/dclk_in1]
connect_bd_net [get_bd_pins clockMux2_0/dclk_out2] [get_bd_pins clockMux3_0/dclk_in2]
connect_bd_net [get_bd_pins clockMux3_0/dclk_out] [get_bd_pins TOF_cos_sl_0/dclk_in_SI]
connect_bd_net [get_bd_pins op_demux_0/gpio_io_o_2] [get_bd_ports gpio_io_o_2]
connect_bd_net [get_bd_pins op_demux_0/gpio_io_o_3] [get_bd_ports gpio_io_o_3]
connect_bd_net [get_bd_pins TOF_cos_sl_0/tcmi_pixel_cnt_DO] [get_bd_pins ila_0/probe1]

# ---- address map ----
assign_bd_address -offset 0x00000000 -range 256M -target_address_space [get_bd_addr_spaces axi_dma_SG_sort/Data_S2MM] [get_bd_addr_segs processing_system7_1/S_AXI_HP3/HP3_DDR_LOWOCM]
assign_bd_address -offset 0x00000000 -range 256M -target_address_space [get_bd_addr_spaces axi_dma_SG_sort/Data_SG] [get_bd_addr_segs processing_system7_1/S_AXI_HP3/HP3_DDR_LOWOCM]
assign_bd_address -offset 0x00000000 -range 256M -target_address_space [get_bd_addr_spaces data2ram_dcs/m00_axi] [get_bd_addr_segs processing_system7_1/S_AXI_HP2/HP2_DDR_LOWOCM]
assign_bd_address -offset 0x00000000 -range 256M -target_address_space [get_bd_addr_spaces data2ram_gs/m00_axi] [get_bd_addr_segs processing_system7_1/S_AXI_HP1/HP1_DDR_LOWOCM]
assign_bd_address -offset 0x40420000 -range 64K -target_address_space [get_bd_addr_spaces processing_system7_1/Data] [get_bd_addr_segs axi_dma_SG_sort/S_AXI_LITE/Reg]
assign_bd_address -offset 0x41200000 -range 64K -target_address_space [get_bd_addr_spaces processing_system7_1/Data] [get_bd_addr_segs axi_gpio_led/S_AXI/Reg]
assign_bd_address -offset 0x41210000 -range 64K -target_address_space [get_bd_addr_spaces processing_system7_1/Data] [get_bd_addr_segs axi_gpio_power_reset/S_AXI/Reg]
assign_bd_address -offset 0x41220000 -range 64K -target_address_space [get_bd_addr_spaces processing_system7_1/Data] [get_bd_addr_segs gpio_shutter/S_AXI/Reg]
assign_bd_address -offset 0x41230000 -range 64K -target_address_space [get_bd_addr_spaces processing_system7_1/Data] [get_bd_addr_segs axi_gpio_Sel1/S_AXI/Reg]
assign_bd_address -offset 0x41240000 -range 64K -target_address_space [get_bd_addr_spaces processing_system7_1/Data] [get_bd_addr_segs axi_gpio_Sel2/S_AXI/Reg]
assign_bd_address -offset 0x43C00000 -range 64K -target_address_space [get_bd_addr_spaces processing_system7_1/Data] [get_bd_addr_segs reg_bank_0/S00_AXI/S00_AXI_reg]
assign_bd_address -offset 0x43C10000 -range 64K -target_address_space [get_bd_addr_spaces processing_system7_1/Data] [get_bd_addr_segs clk_wiz_0/s_axi_lite/Reg]
assign_bd_address -offset 0x44000000 -range 4K -target_address_space [get_bd_addr_spaces processing_system7_1/Data] [get_bd_addr_segs axi_bram_ctrl_dbg_unit/S_AXI/Mem0]
assign_bd_address -offset 0x00000000 -range 256M -target_address_space [get_bd_addr_spaces readRam_burst_1/M00_AXI] [get_bd_addr_segs processing_system7_1/S_AXI_HP0/HP0_DDR_LOWOCM]

validate_bd_design
save_bd_design
